# Altium schematic sheet Music.SchDoc
size A4
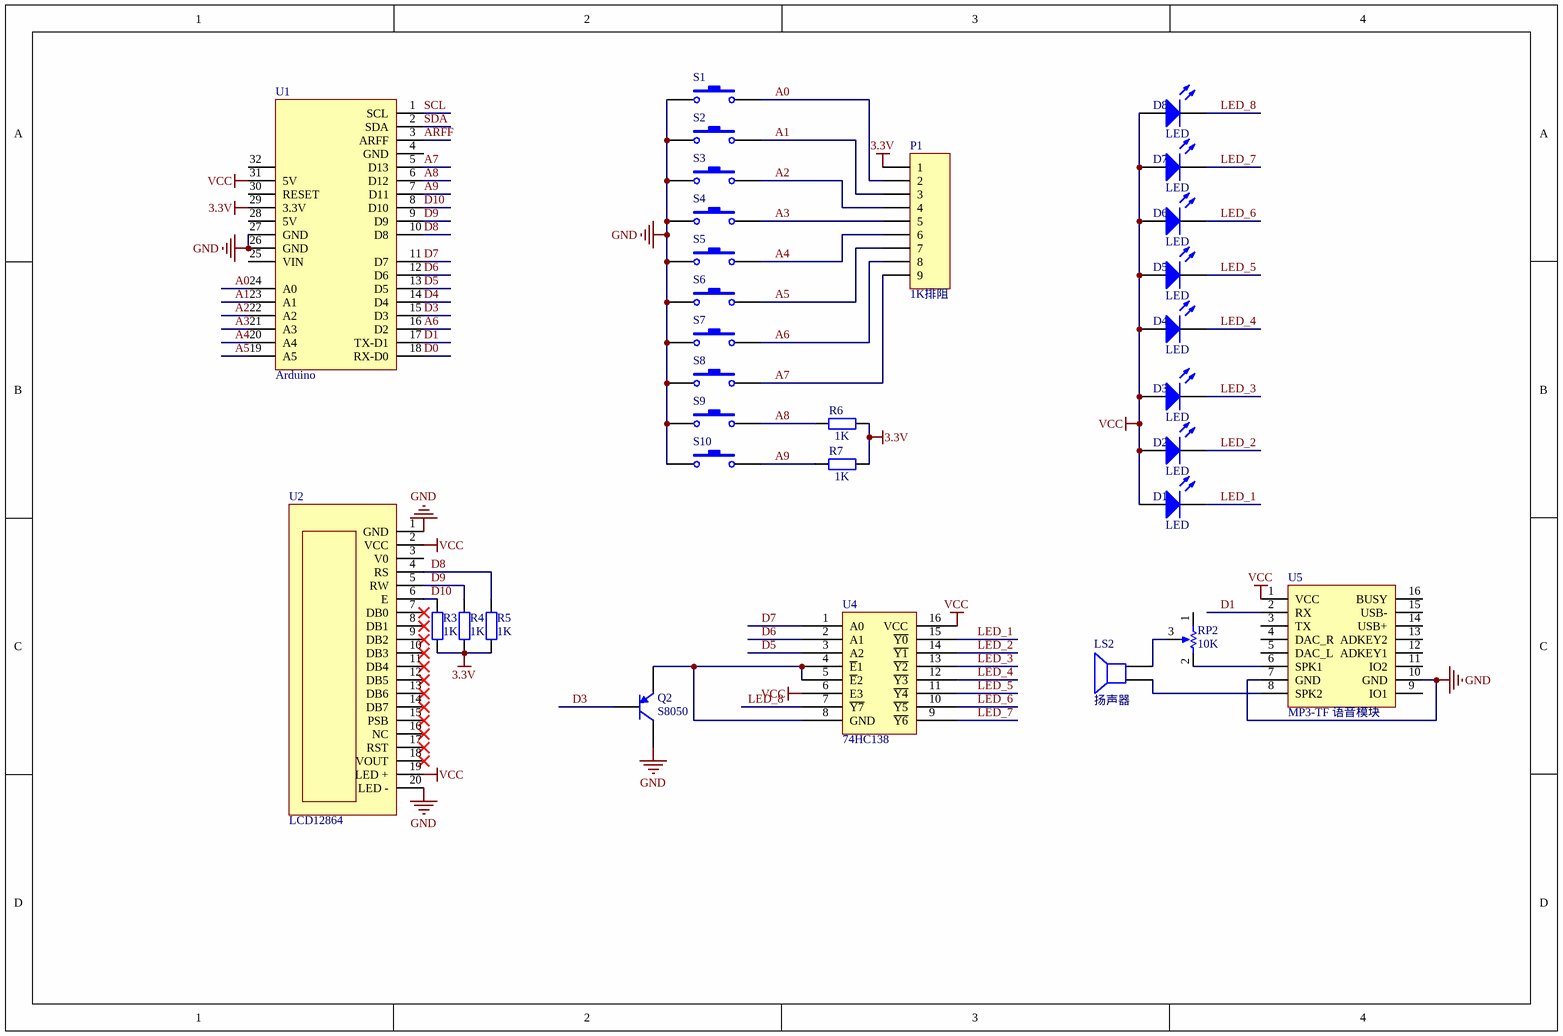
[diagram p0: Music.SchDoc]

## Parts
D1  LED  [LED灯]
D2  LED  [LED灯]
D3  LED  [LED灯]
D4  LED  [LED灯]
D5  LED  [LED灯]
D6  LED  [LED灯]
D7  LED  [LED灯]
D8  LED  [LED灯]
LS2  扬声器  [PIN2]
P1  1K排阻  [9kong-公用]
Q2  S8050  [三极管]
R3  value 1K  [AXIAL-0.4]
R4  value 1K  [AXIAL-0.4]
R5  value 1K  [AXIAL-0.4]
R6  value 1K  [AXIAL-0.4]
R7  value 1K  [AXIAL-0.4]
RP2  value 10K  [3kong-公用]
S1  (no value)  [4kong-独立按键]
S2  (no value)  [4kong-独立按键]
S3  (no value)  [4kong-独立按键]
S4  (no value)  [4kong-独立按键]
S5  (no value)  [4kong-独立按键]
S6  (no value)  [4kong-独立按键]
S7  (no value)  [4kong-独立按键]
S8  (no value)  [4kong-独立按键]
S9  (no value)  [4kong-独立按键]
S10  (no value)  [4kong-独立按键]
U1  Arduino  [Arduino单片机]
U2  LCD12864  [LCD12864]
U4  74HC138  [8+8双排16孔]
U5  MP3-TF 语音模块  [MP3-TF 语音模块]

## Nets
3.3V: P1.1 R3.1 R4.1 R5.1 R6.2 R7.2 U1.29(3.3V)
GND: Q2.3(C) S1.1 S2.1 S3.1 S4.1 S5.1 S6.1 S7.1 S8.1 S9.1 S10.1 U1.26(GND) U1.27(GND) U2.1(GND) U2.20(LED_-) U5.7(GND) U5.10(GND)
VCC: D1.1(A) D2.1(A) D3.1(A) D4.1(A) D5.1(A) D6.1(A) D7.1(A) D8.1(A) U1.31(5V) U2.2(VCC) U2.19(LED_+) U4.6(E3) U4.16(VCC) U5.1(VCC)
A0: P1.2 S1.2 U1.24(A0)
A1: P1.3 S2.2 U1.23(A1)
A2: P1.4 S3.2 U1.22(A2)
A3: P1.5 S4.2 U1.21(A3)
A4: P1.6 S5.2 U1.20(A4)
A5: P1.7 S6.2 U1.19(A5)
A6: P1.8 S7.2 U1.16(D2)
A7: P1.9 S8.2 U1.5(D13)
A8: R6.1 S9.2 U1.6(D12)
A9: R7.1 S10.2 U1.7(D11)
ARFF: U1.3(ARFF)
D0: U1.18(RX-D0)
D1: U1.17(TX-D1) U5.2(RX)
D3: Q2.2(B) U1.15(D3)
D4: U1.14(D4)
D5: U1.13(D5) U4.3(A2)
D6: U1.12(D6) U4.2(A1)
D7: U1.11(D7) U4.1(A0)
D8: R5.2 U1.10(D8) U2.4(RS)
D9: R4.2 U1.9(D9) U2.5(RW)
D10: R3.2 U1.8(D10) U2.6(E)
LED_1: D1.2(K) U4.15(~{Y0})
LED_2: D2.2(K) U4.14(~{Y1})
LED_3: D3.2(K) U4.13(~{Y2})
LED_4: D4.2(K) U4.12(~{Y3})
LED_5: D5.2(K) U4.11(~{Y4})
LED_6: D6.2(K) U4.10(~{Y5})
LED_7: D7.2(K) U4.9(~{Y6})
LED_8: D8.2(K) U4.7(~{Y7})
SCL: U1.1(SCL)
SDA: U1.2(SDA)
NetLS2_1: LS2.1 U5.8(SPK2)
NetLS2_2: LS2.2 RP2.3(TAP)
NetQ2_1: Q2.1(E) U4.4(~{E}1) U4.5(~{E}2) U4.8(GND)
NetRP2_2: RP2.2(BOT) U5.6(SPK1)

Not connected (* = marked no-connect by the designer): RP2 1(TOP); U1 4(GND) 25(VIN) 28(5V) 30(RESET) 32; U2 3(V0) 7(DB0)* 8(DB1)* 9(DB2)* 10(DB3)* 11(DB4)* 12(DB5)* 13(DB6)* 14(DB7)* 15(PSB)* 16(NC)* 17(RST)* 18(VOUT)*; U5 3(TX) 4(DAC_R) 5(DAC_L) 9(IO1) 11(IO2) 12(ADKEY1) 13(ADKEY2) 14(USB+) 15(USB-) 16(BUSY)

## Library data of the parts
D1-D8 = LED0: Typical INFRARED GaAs LED; Published: 8-Jun-2000; LatestRevisionDate: 08-Jul-2005; LatestRevisionNote: Mech Layer 1 removed.; PackageReference: LED-0; Publisher: Altium Limited; PackageDescription: LED; 2 Leads
LS2 = Speaker: Loudspeaker; Published: 24-Mar-1999; LatestRevisionDate: 17-Jul-2002; LatestRevisionNote: Re-released for DXP Platform.; PackageReference: PIN2; Publisher: Altium Limited
P1 = 9kong--排阻
Q2 = 2N3906: PNP General Purpose Amplifier; Published: 8-Jun-2000; LatestRevisionDate: 15-Jan-2003; LatestRevisionNote: PCB Footprint 'BCY-W3/D4.7' replaced; DatasheetVersion: 1997; PackageVersion: Sep-1998; PackageReference: TO-92A; Publisher: Altium Limited; PackageDescription: TO, Flat Index; 3 In-Line, Axial Leads; Body Dia. 4.5mm; Leads 0.51 x 0.48 mm (max); ComponentLink1Description: Manufacturer Link; ComponentLink1URL: http://www.fairchildsemi.com/; ComponentLink2Description: Datasheet; ComponentLink2URL: http://www.fairchildsemi.com/ds/2N%2F2N3906.pdf
R3-R7 = Res2: Resistor; Published: 8-Jun-2000; LatestRevisionDate: 17-Jul-2002; LatestRevisionNote: Re-released for DXP Platform.; PackageReference: AXIAL-0.4; Publisher: Altium Limited; PackageDescription: Axial Device, Thru-Hole; 2 Leads; 0.4 in Pin Spacing
RP2 = RPot: Potentiometer; Sim Note: Enter the Resistance value and the set point into parameter fields.; Set Position: 0.5; Published: 8-Jun-2000; LatestRevisionDate: 17-Jul-2002; LatestRevisionNote: Re-released for DXP Platform.; PackageReference: VR5; Publisher: Altium Limited; PackageDescription: Variable Resistor, Thru-Hole; 3 Leads
S1-S10 = SW-PB: Switch; Published: 24-Mar-1999; LatestRevisionDate: 17-Jul-2002; LatestRevisionNote: Re-released for DXP Platform.; PackageReference: SPST-2; Publisher: Altium Limited; PackageDescription: Switch; 2 Leads